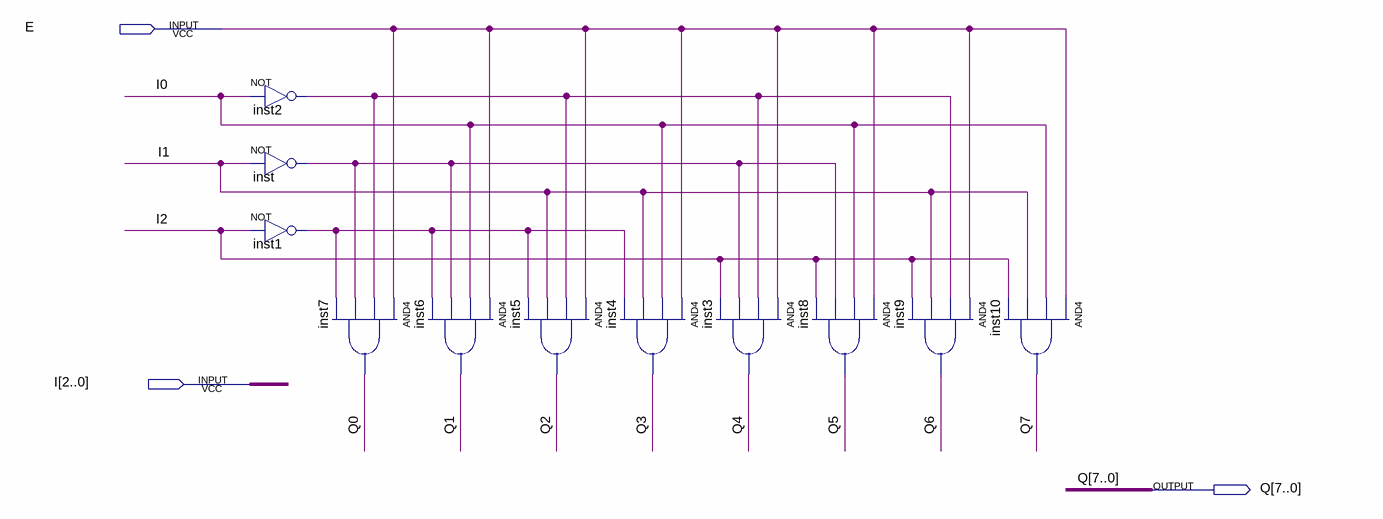
[diagram p0: schematic sheet]
// Quartus schematic decoder3to8.bdf as structural Verilog: 11 symbols, 3 pins
module decoder3to8 (
  input  E,
  input  [2:0] I,
  output [7:0] Q
);

  wire inst1_out, inst2_out, inst_out;

  not inst2 (inst2_out, I[0]);
  not inst (inst_out, I[1]);
  not inst1 (inst1_out, I[2]);
  and inst7 (Q[0], E, inst2_out, inst_out, inst1_out);
  and inst6 (Q[1], E, I[0], inst_out, inst1_out);
  and inst5 (Q[2], E, inst2_out, I[1], inst1_out);
  and inst4 (Q[3], E, I[0], I[1], inst1_out);
  and inst3 (Q[4], E, inst2_out, inst_out, I[2]);
  and inst8 (Q[5], E, I[0], inst_out, I[2]);
  and inst9 (Q[6], E, inst2_out, I[1], I[2]);
  and inst10 (Q[7], E, I[0], I[1], I[2]);
endmodule
